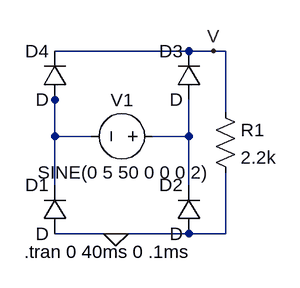
[diagram p0: schematic Versuch5_Lab1.asc]
Versuch5_Lab1.asc, the LTspice schematic file:
Version 4
SHEET 1 880 680
WIRE 160 80 -16 80
WIRE 192 80 160 80
WIRE 208 80 192 80
WIRE -16 144 -16 128
WIRE 208 160 208 80
WIRE -16 192 -16 144
WIRE 32 192 -16 192
WIRE 160 192 160 144
WIRE 160 192 112 192
WIRE -16 256 -16 192
WIRE 160 256 160 192
WIRE 64 320 -16 320
WIRE 160 320 64 320
WIRE 208 320 208 240
WIRE 208 320 160 320
FLAG 64 320 0
FLAG 192 80 V
SYMBOL diode 176 144 R180
WINDOW 0 24 64 Left 2
WINDOW 3 24 0 Left 2
SYMATTR InstName D3
SYMBOL voltage 128 192 R90
WINDOW 0 -32 56 VBottom 2
WINDOW 3 32 56 VTop 2
WINDOW 123 0 0 Left 0
WINDOW 39 0 0 Left 0
SYMATTR InstName V1
SYMATTR Value SINE(0 5 50 0 0 0 2)
SYMBOL diode 0 144 R180
WINDOW 0 24 64 Left 2
WINDOW 3 24 0 Left 2
SYMATTR InstName D4
SYMBOL diode 0 320 R180
WINDOW 0 24 64 Left 2
WINDOW 3 24 0 Left 2
SYMATTR InstName D1
SYMBOL diode 176 320 R180
WINDOW 0 24 64 Left 2
WINDOW 3 24 0 Left 2
SYMATTR InstName D2
SYMBOL res 192 144 R0
SYMATTR InstName R1
SYMATTR Value 2.2k
TEXT -56 344 Left 2 !.tran 0 40ms 0 .1ms

The netlist it stands for:
* Versuch5_Lab1.asc
D3 N002 V D
V1 N002 N001 SINE(0 5 50 0 0 0 2)
D4 N001 V D
D1 0 N001 D
D2 0 N002 D
R1 V 0 2.2k
.model D D
.lib standard.dio
.tran 0 40ms 0 .1ms
.backanno
.end